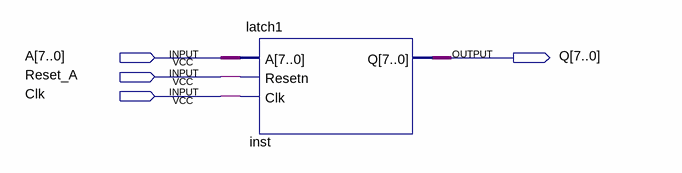
[diagram p0: schematic sheet]
// Quartus schematic latch1b.bdf as structural Verilog: 1 symbols, 4 pins
module latch1b (
  input  [7:0] A,
  input  Reset_A,
  input  Clk,
  output [7:0] Q
);

  latch1 inst (.A(A), .Resetn(Reset_A), .Clk(Clk), .Q(Q));
endmodule
